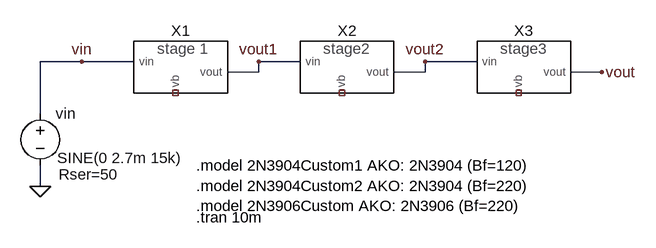
[diagram p0: schematic integration_trans.asc]
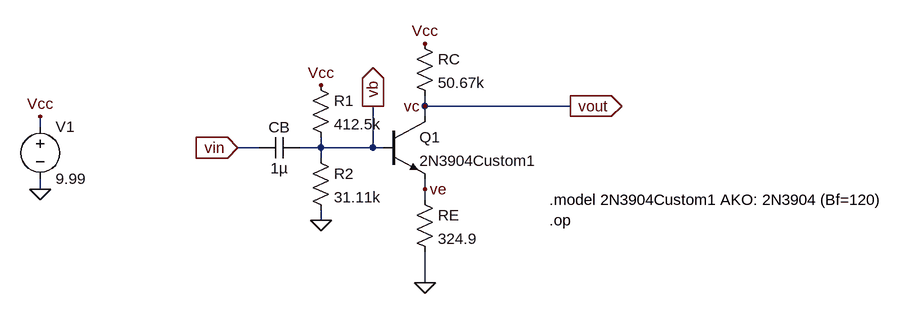
[diagram p1: sub-circuit stage1.asc]
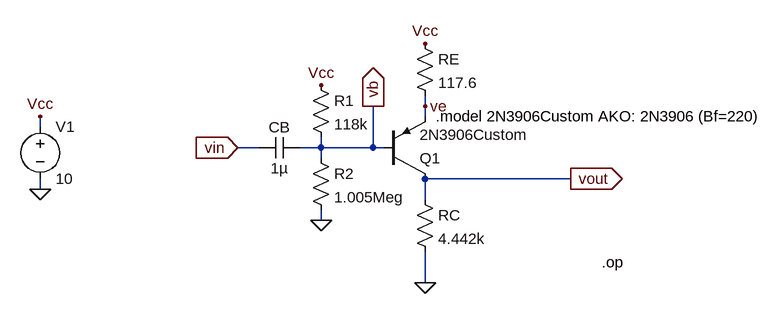
[diagram p2: sub-circuit stage2.asc]
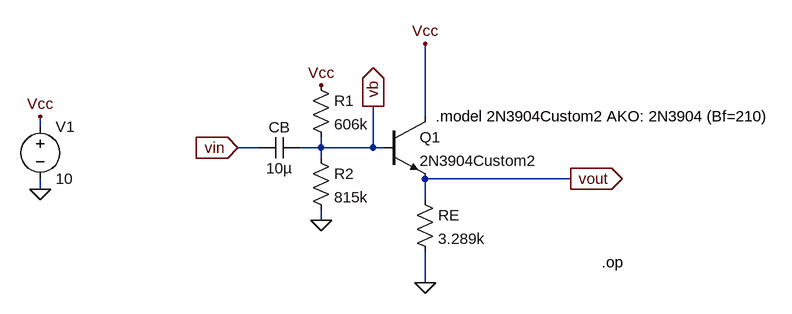
[diagram p3: sub-circuit stage3.asc]
integration_trans.asc, the LTspice schematic file:
Version 4
SHEET 1 1200 680
WIRE 336 112 272 112
WIRE 416 112 336 112
WIRE 672 112 608 112
WIRE 944 112 864 112
WIRE 608 128 608 112
WIRE 608 128 560 128
WIRE 864 128 864 112
WIRE 864 128 816 128
WIRE 1136 128 1088 128
WIRE 272 192 272 112
WIRE 272 304 272 272
FLAG 272 304 0
FLAG 1136 128 vout
FLAG 336 112 vin
FLAG 608 112 vout1
FLAG 864 112 vout2
SYMBOL Voltage 272 176 R0
WINDOW 123 31 87 Left 2
WINDOW 3 26 84 Left 2
WINDOW 39 28 110 Left 2
SYMATTR Value SINE(0 2.7m 15k)
SYMATTR SpiceLine Rser=50
SYMATTR InstName vin
SYMBOL stage1 480 112 R0
SYMATTR InstName X1
SYMBOL stage2 736 112 R0
SYMATTR InstName X2
SYMBOL stage3 1008 128 R0
SYMATTR InstName X3
TEXT 512 352 Left 2 !.tran 10m
TEXT 512 272 Left 2 !.model 2N3904Custom1 AKO: 2N3904 (Bf=120)\n.model 2N3904Custom2 AKO: 2N3904 (Bf=220)\n.model 2N3906Custom AKO: 2N3906 (Bf=220)

stage1.asc, the sub-circuit schematic file:
Version 4
SHEET 1 1252 680
WIRE 528 160 528 144
WIRE 752 160 528 160
WIRE 528 176 528 160
WIRE -64 192 -64 176
WIRE 272 224 240 224
WIRE 368 224 368 208
WIRE 368 224 336 224
WIRE 448 224 448 160
WIRE 448 224 368 224
WIRE 464 224 448 224
WIRE 368 240 368 224
WIRE -64 288 -64 272
WIRE 528 288 528 272
WIRE 528 304 528 288
WIRE 368 336 368 320
WIRE 528 432 528 384
FLAG 368 336 0
FLAG 240 224 vin
IOPIN 240 224 In
FLAG 448 160 vb
IOPIN 448 160 Out
FLAG 528 160 vc
FLAG 368 128 Vcc
FLAG 528 64 Vcc
FLAG 752 160 vout
IOPIN 752 160 Out
FLAG 528 432 0
FLAG -64 288 0
FLAG -64 176 Vcc
FLAG 528 288 ve
SYMBOL Res 352 112 R0
SYMATTR InstName R1
SYMATTR Value 412.5k
SYMBOL Res 352 224 R0
SYMATTR InstName R2
SYMATTR Value 31.11k
SYMBOL Cap 336 208 R90
WINDOW 0 0 32 VBottom 2
WINDOW 3 32 32 VTop 2
SYMATTR InstName CB
SYMATTR Value 1µ
SYMBOL Res 512 48 R0
SYMATTR InstName RC
SYMATTR Value 50.67k
SYMBOL Res 512 288 R0
SYMATTR InstName RE
SYMATTR Value 324.9
SYMBOL Voltage -64 176 R0
SYMATTR InstName V1
SYMATTR Value 9.99
SYMBOL npn 464 176 R0
SYMATTR InstName Q1
SYMATTR Value 2N3904Custom1
TEXT 720 304 Left 2 !.model 2N3904Custom1 AKO: 2N3904 (Bf=120)
TEXT 720 336 Left 2 !.op

stage2.asc, the sub-circuit schematic file:
Version 4
SHEET 1 1220 680
WIRE 528 160 528 144
WIRE 528 176 528 160
WIRE -64 192 -64 176
WIRE 272 224 240 224
WIRE 368 224 368 208
WIRE 368 224 336 224
WIRE 448 224 448 160
WIRE 448 224 368 224
WIRE 464 224 448 224
WIRE 368 240 368 224
WIRE 752 272 528 272
WIRE -64 288 -64 272
WIRE 528 304 528 272
WIRE 368 336 368 320
WIRE 528 432 528 384
FLAG 368 336 0
FLAG 240 224 vin
IOPIN 240 224 In
FLAG 448 160 vb
IOPIN 448 160 Out
FLAG 528 160 ve
FLAG 368 128 Vcc
FLAG 528 64 Vcc
FLAG 752 272 vout
IOPIN 752 272 Out
FLAG 528 432 0
FLAG -64 288 0
FLAG -64 176 Vcc
SYMBOL Res 352 112 R0
SYMATTR InstName R1
SYMATTR Value 118k
SYMBOL Res 352 224 R0
SYMATTR InstName R2
SYMATTR Value 1.005Meg
SYMBOL Cap 336 208 R90
WINDOW 0 0 32 VBottom 2
WINDOW 3 32 32 VTop 2
SYMATTR InstName CB
SYMATTR Value 1µ
SYMBOL Res 512 48 R0
SYMATTR InstName RE
SYMATTR Value 117.6
SYMBOL Res 512 288 R0
SYMATTR InstName RC
SYMATTR Value 4.442k
SYMBOL pnp 464 272 M180
SYMATTR InstName Q1
SYMATTR Value 2N3906Custom
SYMBOL Voltage -64 176 R0
SYMATTR InstName V1
SYMATTR Value 10
TEXT 544 176 Left 2 !.model 2N3906Custom AKO: 2N3906 (Bf=220)
TEXT 800 400 Left 2 !.op

stage3.asc, the sub-circuit schematic file:
Version 4
SHEET 1 1220 680
WIRE 528 176 528 64
WIRE -64 192 -64 176
WIRE 272 224 240 224
WIRE 368 224 368 208
WIRE 368 224 336 224
WIRE 448 224 448 160
WIRE 448 224 368 224
WIRE 464 224 448 224
WIRE 368 240 368 224
WIRE 752 272 528 272
WIRE -64 288 -64 272
WIRE 528 304 528 272
WIRE 368 336 368 320
WIRE 528 432 528 384
FLAG 368 336 0
FLAG 240 224 vin
IOPIN 240 224 In
FLAG 448 160 vb
IOPIN 448 160 Out
FLAG 368 128 Vcc
FLAG 528 64 Vcc
FLAG 752 272 vout
IOPIN 752 272 Out
FLAG 528 432 0
FLAG -64 288 0
FLAG -64 176 Vcc
SYMBOL Res 352 112 R0
SYMATTR InstName R1
SYMATTR Value 606k
SYMBOL Res 352 224 R0
SYMATTR InstName R2
SYMATTR Value 815k
SYMBOL Cap 336 208 R90
WINDOW 0 0 32 VBottom 2
WINDOW 3 32 32 VTop 2
SYMATTR InstName CB
SYMATTR Value 10µ
SYMBOL Res 512 288 R0
SYMATTR InstName RE
SYMATTR Value 3.289k
SYMBOL Voltage -64 176 R0
SYMATTR InstName V1
SYMATTR Value 10
SYMBOL npn 464 176 R0
SYMATTR InstName Q1
SYMATTR Value 2N3904Custom2
TEXT 544 176 Left 2 !.model 2N3904Custom2 AKO: 2N3904 (Bf=210)
TEXT 800 400 Left 2 !.op

The netlist it stands for:
* integration_trans.asc
vin vin 0 SINE(0 2.7m 15k) Rser=50
XX1 vin NC_01 vout1 stage1
XX2 vout1 NC_02 vout2 stage2
XX3 vout2 NC_03 vout stage3

* block symbol definitions
.subckt stage1 vin vb vout
R1 Vcc vb 412.5k
R2 vb 0 31.11k
CB vb vin 1µ
RC Vcc vout 50.67k
RE ve 0 324.9
V1 Vcc 0 9.99
Q1 vout vb ve 0 2N3904Custom1
.model 2N3904Custom1 AKO: 2N3904 (Bf=120)
.op
.ends stage1

.subckt stage2 vin vb vout
R1 Vcc vb 118k
R2 vb 0 1.005Meg
CB vb vin 1µ
RE Vcc ve 117.6
RC vout 0 4.442k
Q1 vout vb ve 0 2N3906Custom
V1 Vcc 0 10
.model 2N3906Custom AKO: 2N3906 (Bf=220)
.op
.ends stage2

.subckt stage3 vin vb vout
R1 Vcc vb 606k
R2 vb 0 815k
CB vb vin 10µ
RE vout 0 3.289k
V1 Vcc 0 10
Q1 Vcc vb vout 0 2N3904Custom2
.model 2N3904Custom2 AKO: 2N3904 (Bf=210)
.op
.ends stage3

.model NPN NPN
.model PNP PNP
.lib standard.bjt
.tran 10m
.model 2N3904Custom1 AKO: 2N3904 (Bf=120)
.model 2N3904Custom2 AKO: 2N3904 (Bf=220)
.model 2N3906Custom AKO: 2N3906 (Bf=220)
.backanno
.end